# EAGLE design rotary-encoder_carrier (EAGLE 6.2)
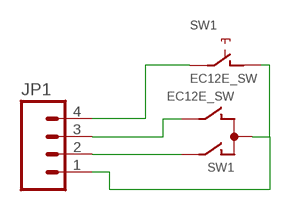
[diagram p0: schematic, sheet 1]

## Parts
JP1  M04LONGPADS  [1X04_LONGPADS]
SW1  EC12E_SW  [ALPS_EC11E_SW]

## Nets
N$1: JP1.2 SW1.A
N$2: JP1.3 SW1.B
N$3: JP1.1 SW1.C SW1.D
N$4: JP1.4 SW1.E
Unconnected: SW1.GND1(G) SW1.GND2(G)

## Library data of the parts
JP1 = SparkFun-Connectors:M04: Header 4 Standard 4-pin 0.1" header. Use with straight break away headers (SKU : PRT-00116), right angle break away headers (PRT-00553), swiss pins (PRT-00743), machine pins (PRT-00117), and female headers (PRT-00115). Molex polarized connector foot print use with SKU : PRT-08231 with associated crimp pins and housings. 1MM SMD Version SKU: PRT-10208
SW1 = switch-alps_11m:EC12E_SW: ALPS rotary Encoder EC12E series with switch; MPN: EC12E2424407; OC_FARNELL: 1520813; OC_NEWARK: 74M1068

## Board
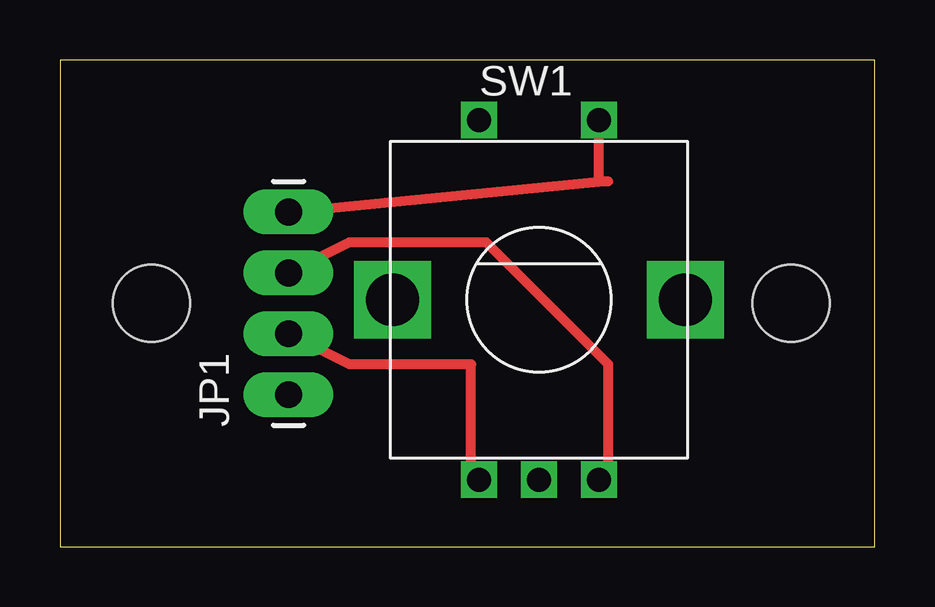
[diagram p1: board, top side]
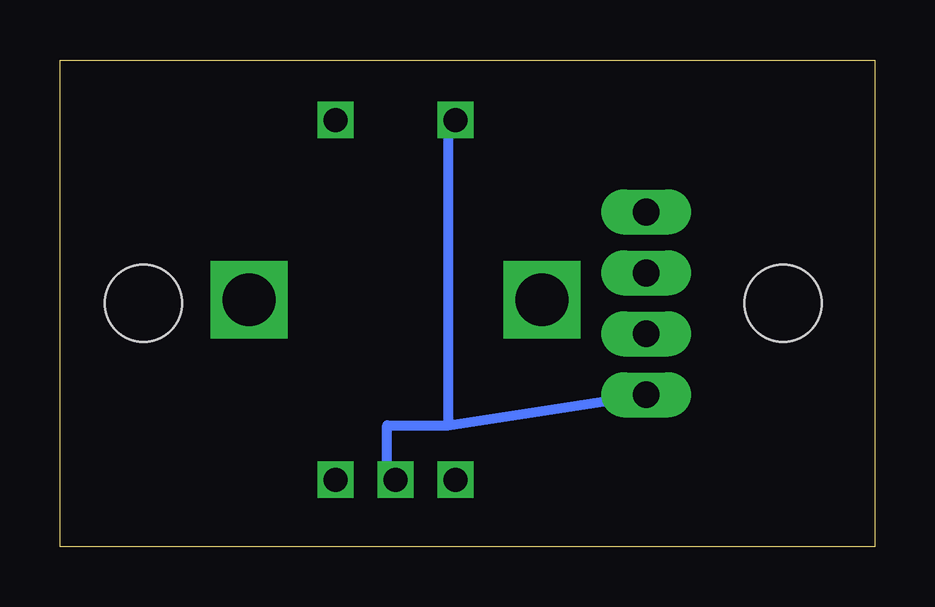
[diagram p2: board, bottom side, seen from below]

Size 33.96 x 20.31 mm. Coordinates in mm from the lower left corner, seen from the top.
Outline: 0,0 33.96,0 33.96,20.31 0,20.31 0,0
Copper layers (1*16): Top 0.035mm / dielectric 1.5mm / Bottom 0.035mm
Design rules: minimum track width 10mil, minimum drill 24mil, track to track 8mil, track to pad 8mil, pad to pad 8mil, via to via 8mil, smd to smd 8mil, copper to edge 40mil, drill to drill 8mil, minimum pad ring 10mil, minimum via ring 8mil, stop-mask expansion 4mil, vias tented up to drill 0mil, thermal gap 10mil
Holes 3.2 mm at 3.81,10.16 30.48,10.16

### Footprints (pad centres in the part's own frame; a part is rotated, then mirrored left to right if it is on the bottom)
1X04_LONGPADS = drill 1.118 pad 1.88 long: 1 0,0; 2 2.54,0; 3 5.08,0; 4 7.62,0
ALPS_EC11E_SW = drill 1 square: A 3.5,-1; B 8.5,-1; C 6,-1; D 3.5,14; E 8.5,14 | drill 2.2 square: GND1 -0.1,6.5; GND2 12.1,6.5

### Placement (x,y rotation side)
JP1  9.53,6.35 90 top
SW1  13.97,3.81 0 top

### Tracks (layer width: path | path; a pad name or v marks a point on that pad's centre or on a via)
N$1
  Top 0.406: SW1.A 17.14,3.13 17.14,7.62 12.06,7.62 JP1.2
N$2
  Top 0.406: JP1.3 12.06,12.7 17.78,12.7 22.86,7.62 22.86,3.2 SW1.B
N$3
  Bottom 0.406: SW1.C 20.32,2.81 20.32,5.08 17.78,5.08 | 17.78,5.08 JP1.1 | SW1.D 17.78,17.81 17.78,5.08
N$4
  Top 0.406: JP1.4 22.47,15.24 | 22.86,15.24 22.47,15.24 | 22.47,15.24 SW1.E